# Altium project RSX_High_Power_Board.PrjPcb (part 2 of 2)

## Sheet 3V3_board.SchDoc
size A4
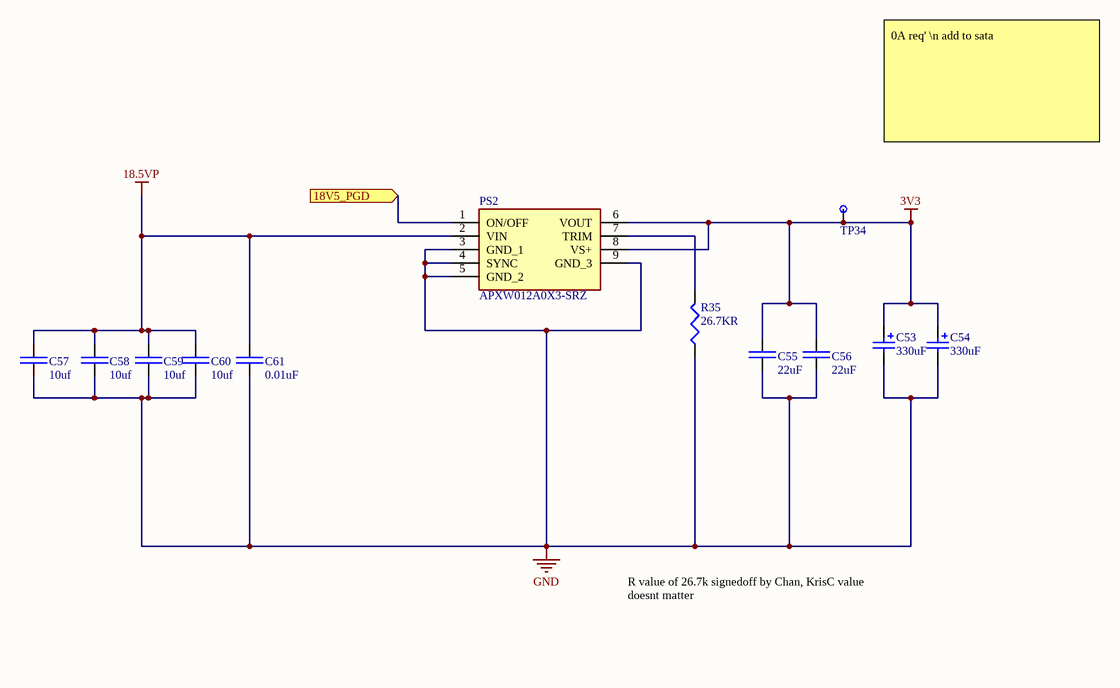
[diagram p11: 3V3_board.SchDoc]

### Parts
C53  330uF  [330uF throught hole]
C54  330uF  [330uF throught hole]
C55  22uF  [22uF Capacitor]
C56  22uF  [22uF Capacitor]
C57  10uf  [10uF capacitor LPB]
C58  10uf  [10uF capacitor LPB]
C59  10uf  [10uF capacitor LPB]
C60  10uf  [10uF capacitor LPB]
C61  0.01uF  [0.01uF capacitor]
PS2  APXW012A0X3-SRZ  [APXW012A0X3SRZ]
R35  26.7KR  [26.7KR Resistor]
TP34  TestPt  [50_MIL_PAD]  (value not drawn)

### Ports
18V5_PGD (in)

### Nets
3V3: C53.1 C54.1 C55.2 C56.2 PS2.6(VOUT) PS2.8(VS+) TP34.1
18.5VP: C57.2 C58.2 C59.2 C60.2 C61.2 PS2.2(VIN)
GND: C53.2 C54.2 C55.1 C56.1 C57.1 C58.1 C59.1 C60.1 C61.1 PS2.3(GND_1) PS2.4(SYNC) PS2.5(GND_2) PS2.9(GND_3) R35.1
NetPS1_1: PS2.1(ON/OFF) ; port 18V5_PGD
NetPS2_7: PS2.7(TRIM) R35.2

### Notes on the sheet
- 0A req' \n add to sata
- R value of 26.7k signedoff by Chan, KrisC value doesnt matter

### Library data of the parts
C53 C54 = 35ZLH330MEFCT810X12.5: CAP ALUM 330UF 20% 35V RADIAL; Manufacturer 1: Rubycon; Ripple Current: 731.5mA; Impedance: 39mR; Life (Hours): 10000Hour; Supplier 1: Digi-Key; Supplier Part Number 1: 1189-3752-1-ND; Manufacturer Part Number 1: 35ZLH330MEFCT810X12.5; Stock 1: 14330; Pricing 1: 1=0,52000, 10=0,36900, 100=0,24280 (USD); RoHS: Yes; Mount: Through Hole; Case/Package: Radial; Min Operating Temperature: -40°C; Max Operating Temperature: 105°C; Package Quantity: 1000; Capacitance: 330uF; Packaging: Tape and Reel; Tolerance: 20%; Voltage Rating: 35V; Lead Pitch: 0.197inch; Height - Seated (Max): 0.551inch; ComponentLink1URL: http://www.rubycon.co.jp/en/catalog/e_pdfs/aluminum/e_ZLH.pdf?src-supplier=Digi-Key; ComponentLink1Description: http://www.rubycon.co.jp/en/catalog/e_pdfs/aluminum/e_ZLH.pdf?src-supplier=Digi-Key; ComponentLink2URL: http://www.rubycon.co.jp/en/catalog/e_pdfs/aluminum/Radial_Lead_Alumi_Eng.pdf?src-supplier=Digi-Key; ComponentLink2Description: http://www.rubycon.co.jp/en/catalog/e_pdfs/aluminum/Radial_Lead_Alumi_Eng.pdf?src-supplier=Digi-Key
C55 C56 = GRM32ER71E226KE15L: Cap Ceramic 22uF 25V X7R 10% SMD 1210 125C Embossed T/R; Manufacturer 1: Murata; Supplier 1: Digi-Key; Supplier Part Number 1: 490-5313-6-ND; Manufacturer Part Number 1: GRM32ER71E226KE15L; Stock 1: 52660; Pricing 1: 1=1,78000, 10=1,40600, 100=1,05410, 500=0,79646 (USD); RoHS: Yes; Mount: Surface Mount; Case/Package: 1210; Number of Pins: 2; Case Code (Metric): 3225; Case Code (Imperial): 1210; Material: Ceramic; Min Operating Temperature: -55°C; Max Operating Temperature: 125°C; Capacitance: 22uF; Tolerance: 10%; Dielectric: X7R; Voltage Rating: 25V; Packaging: Tape and Reel; Package Quantity: 1; Voltage Rating (DC): 25V; Termination: SMD/SMT; Voltage: 25V; Length: 3.2mm; Height: 2.5mm; Width: 0.098inch; Thickness: 0.106inch; Depth: 2.5mm; Radiation Hardening: No; REACH SVHC: No SVHC; Lead Free: Lead Free; ComponentLink1URL: https://datasheet.ciiva.com/6072/1697714-6072768.pdf?src-supplier=Farnell; ComponentLink1Description: https://datasheet.ciiva.com/6072/1697714-6072768.pdf?src-supplier=Farnell; ComponentLink2URL: https://datasheet.ciiva.com/16497/product-16497009.pdf?src-supplier=Future+Electronics; ComponentLink2Description: https://datasheet.ciiva.com/16497/product-16497009.pdf?src-supplier=Future+Electronics; ComponentLink3URL: https://datasheet.ciiva.com/3776/2741grm32er71e226ke1523-3776996.pdf?src-supplier=Arrow; ComponentLink3Description: https://datasheet.ciiva.com/3776/2741grm32er71e226ke1523-3776996.pdf?src-supplier=Arrow; ComponentLink4URL: https://datasheet.ciiva.com/11789/0900766b80ef921d-11789129.pdf?src-supplier=RSComponents; ComponentLink4Description: https://datasheet.ciiva.com/11789/0900766b80ef921d-11789129.pdf?src-supplier=RSComponents; ComponentLink5URL: https://datasheet.ciiva.com/29201/451826-da-01-de-vs-kondens-grm32-er71e-226ke15l-29201795.pdf?src-supplier=Conrad; ComponentLink5Description: https://datasheet.ciiva.com/29201/451826-da-01-de-vs-kondens-grm32-er71e-226ke15l-29201795.pdf?src-supplier=Conrad; ComponentLink6URL: https://datasheet.ciiva.com/175/partnumbering-e-01-175746.pdf?src-supplier=Digi-Key; ComponentLink6Description: https://datasheet.ciiva.com/175/partnumbering-e-01-175746.pdf?src-supplier=Digi-Key; ComponentLink7URL: https://datasheet.ciiva.com/175/partnumbering-e-01-175747.pdf?src-supplier=Digi-Key; ComponentLink7Description: https://datasheet.ciiva.com/175/partnumbering-e-01-175747.pdf?src-supplier=Digi-Key; ComponentLink8URL: https://datasheet.ciiva.com/175/partnumbering-e-01-175748.pdf?src-supplier=Digi-Key; ComponentLink8Description: https://datasheet.ciiva.com/175/partnumbering-e-01-175748.pdf?src-supplier=Digi-Key; ComponentLink9URL: https://datasheet.ciiva.com/22703/1697714-22703397.pdf?src-supplier=Element14; ComponentLink9Description: https://datasheet.ciiva.com/22703/1697714-22703397.pdf?src-supplier=Element14; Category: Capacitor
C57-C60 = GRT31CR61H106ME01L: CAP CER 10UF 50V X5R 1206; Manufacturer 1: Murata; Tolerance: 20%; Supplier 1: Digi-Key; Supplier Part Number 1: 490-12457-1-ND; Manufacturer Part Number 1: GRT31CR61H106ME01L; Stock 1: 8159; Pricing 1: 1=0,50000, 10=0,34900, 100=0,20920, 500=0,15690, 1000=0,13249 (USD); RoHS: Yes; Mount: Surface Mount; Case/Package: 1206; Case Code (Metric): 3216; Case Code (Imperial): 1206; Min Operating Temperature: -55°C; Max Operating Temperature: 85°C; Packaging: Tape and Reel; Capacitance: 10uF; Voltage Rating: 50V; Length: 0.126inch; Width: 0.063inch; Thickness: 0.071inch; Ratings: AEC-Q200; ComponentLink1URL: http://search.murata.co.jp/Ceramy/image/img/A01X/G101/ENG/GRT31CR61H106ME01-01.pdf?src-supplier=Digi-Key; ComponentLink1Description: http://search.murata.co.jp/Ceramy/image/img/A01X/G101/ENG/GRT31CR61H106ME01-01.pdf?src-supplier=Digi-Key; Category: Capacitor
C61 = C0603C103KARACAUTO: Cap Ceramic 0.01uF 250V X7R 10% Pad SMD 0603 125C Automotive T/R; Manufacturer 1: KEMET; Capacitance: 10nF; Supplier 1: Digi-Key; Supplier Part Number 1: 399-17960-1-ND; Manufacturer Part Number 1: C0603C103KARACAUTO; Stock 1: 8483; Pricing 1: 1=0,90000, 10=0,68500, 100=0,49040, 500=0,37964, 1000=0,32691 (USD); RoHS: No; Mount: Surface Mount; Case/Package: 0603; Case Code (Imperial): 0603; Case Code (Metric): 1608; Min Operating Temperature: -55°C; Max Operating Temperature: 125°C; Packaging: Tape and Reel; Tolerance: 10%; Voltage Rating: 250V; Ratings: AEC-Q200; ComponentLink1URL: https://api.kemet.com/component-edge/download/datasheet/C0603C103KARACAUTO.pdf?src-supplier=Digi-Key; ComponentLink1Description: https://api.kemet.com/component-edge/download/datasheet/C0603C103KARACAUTO.pdf?src-supplier=Digi-Key; Category: Capacitor
PS2 = APXW012A0X3-SRZ: Power Supply; Manufacturer_Name: ABB; Datasheet Link: https://datasheet.datasheetarchive.com/originals/distributors/Datasheets_SAMA/683ccf345f63793608341fe806dd9fff.pdf; Height: 10mm; Manufacturer_Part_Number: APXW012A0X3-SRZ; Mouser Part Number: 894-APXW012A0X3-SRZ; Mouser Price/Stock: https://www.mouser.co.uk/ProductDetail/ABB/APXW012A0X3-SRZ?qs=R2DZpqZpp70Xpp2aKRKJXQ%3D%3D
R35 = ERA-3AEB2672V: RES SMD 26.7KOHM 0.1% 1/10W 0603; Manufacturer 1: Panasonic; Power Rating: 100mW; Voltage Rating: 75V; Temperature Coefficient: 25ppm/°C; Supplier 1: Digi-Key; Supplier Part Number 1: P26.7KDBCT-ND; Manufacturer Part Number 1: ERA-3AEB2672V; Stock 1: 17260; Pricing 1: 1=0,35000, 10=0,30000, 100=0,11720, 1000=0,04906, 2500=0,04498 (USD); RoHS: Yes; Mount: Surface Mount; Case/Package: 0603; Number of Pins: 2; Case Code (Metric): 1608; Case Code (Imperial): 0603; Contact Plating: Tin; Min Operating Temperature: -55°C; Max Operating Temperature: 155°C; Resistance: 26.7kR; Tolerance: 0.1%; Packaging: Tape and Reel; Package Quantity: 1; Composition: Thin Film,Metal Film; Number of Terminations: 2; Max Power Dissipation: 100mW; Voltage Rating (DC): 75V; Features: Automotive AEC-Q200; Length: 1.6mm; Height: 0.45mm; Width: 0.8mm; Depth: 0.8mm; Radiation Hardening: No; Lead Free: Lead Free; REACH SVHC: No SVHC; ComponentLink1URL: https://datasheet.ciiva.com/11814/0900766b80eb1d8c-11814836.pdf?src-supplier=RSComponents; ComponentLink1Description: https://datasheet.ciiva.com/11814/0900766b80eb1d8c-11814836.pdf?src-supplier=RSComponents; ComponentLink2URL: https://datasheet.ciiva.com/5987/485442-5987192.pdf?src-supplier=Farnell; ComponentLink2Description: https://datasheet.ciiva.com/5987/485442-5987192.pdf?src-supplier=Farnell; ComponentLink3URL: https://datasheet.ciiva.com/5987/485442-5987183.pdf?src-supplier=Farnell; ComponentLink3Description: https://datasheet.ciiva.com/5987/485442-5987183.pdf?src-supplier=Farnell; ComponentLink4URL: https://datasheet.ciiva.com/46422/485442-46422629.pdf?src-supplier=Element14; ComponentLink4Description: https://datasheet.ciiva.com/46422/485442-46422629.pdf?src-supplier=Element14; ComponentLink5URL: https://datasheet.ciiva.com/17210/aoa0000ce26-17210681.pdf?src-supplier=Avnet+Europe; ComponentLink5Description: https://datasheet.ciiva.com/17210/aoa0000ce26-17210681.pdf?src-supplier=Avnet+Europe

## Sheet 5V_board.SchDoc
size A4
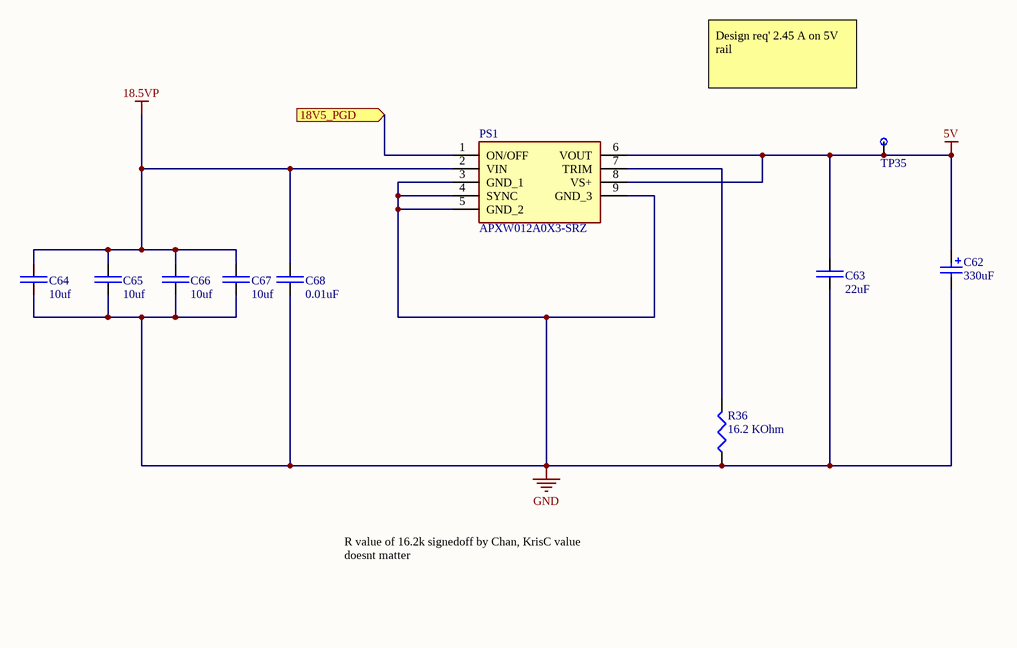
[diagram p12: 5V_board.SchDoc]

### Parts
C62  330uF  [330uF throught hole]
C63  22uF  [22uF Capacitor]
C64  10uf  [10uF capacitor LPB]
C65  10uf  [10uF capacitor LPB]
C66  10uf  [10uF capacitor LPB]
C67  10uf  [10uF capacitor LPB]
C68  0.01uF  [0.01uF capacitor]
PS1  APXW012A0X3-SRZ  [APXW012A0X3SRZ]
R36  16.2 KOhm  [16.2 KOhm Resistor]
TP35  TestPt  [50_MIL_PAD]  (value not drawn)

### Ports
18V5_PGD (in)

### Nets
5V: C62.1 C63.2 PS1.6(VOUT) PS1.8(VS+) TP35.1
18.5VP: C64.2 C65.2 C66.2 C67.2 C68.2 PS1.2(VIN)
GND: C62.2 C63.1 C64.1 C65.1 C66.1 C67.1 C68.1 PS1.3(GND_1) PS1.4(SYNC) PS1.5(GND_2) PS1.9(GND_3) R36.1
NetPS1_1: PS1.1(ON/OFF) ; port 18V5_PGD
NetPS1_7: PS1.7(TRIM) R36.2

### Notes on the sheet
- Design req' 2.45 A on 5V rail
- R value of 16.2k signedoff by Chan, KrisC value doesnt matter

### Library data of the parts
C62 = 35ZLH330MEFCT810X12.5: as C53 on sheet 3V3_board; Supplier 1: Digi-Key; Supplier Part Number 1: 1189-3752-1-ND; Manufacturer Part Number 1: 35ZLH330MEFCT810X12.5; Stock 1: 14330; Pricing 1: 1=0,52000, 10=0,36900, 100=0,24280 (USD); RoHS: Yes; Mount: Through Hole; Case/Package: Radial; Min Operating Temperature: -40°C; Max Operating Temperature: 105°C; Package Quantity: 1000; Capacitance: 330uF; Packaging: Tape and Reel; Tolerance: 20%; Voltage Rating: 35V; Lead Pitch: 0.197inch; Height - Seated (Max): 0.551inch; ComponentLink1URL: http://www.rubycon.co.jp/en/catalog/e_pdfs/aluminum/e_ZLH.pdf?src-supplier=Digi-Key; ComponentLink1Description: http://www.rubycon.co.jp/en/catalog/e_pdfs/aluminum/e_ZLH.pdf?src-supplier=Digi-Key; ComponentLink2URL: http://www.rubycon.co.jp/en/catalog/e_pdfs/aluminum/Radial_Lead_Alumi_Eng.pdf?src-supplier=Digi-Key; ComponentLink2Description: http://www.rubycon.co.jp/en/catalog/e_pdfs/aluminum/Radial_Lead_Alumi_Eng.pdf?src-supplier=Digi-Key
C63 = GRM32ER71E226KE15L: as C55 on sheet 3V3_board; Supplier 1: Digi-Key; Supplier Part Number 1: 490-5313-6-ND; Manufacturer Part Number 1: GRM32ER71E226KE15L; Stock 1: 52660; Pricing 1: 1=1,78000, 10=1,40600, 100=1,05410, 500=0,79646 (USD); RoHS: Yes; Mount: Surface Mount; Case/Package: 1210; Number of Pins: 2; Case Code (Metric): 3225; Case Code (Imperial): 1210; Material: Ceramic; Min Operating Temperature: -55°C; Max Operating Temperature: 125°C; Capacitance: 22uF; Tolerance: 10%; Dielectric: X7R; Voltage Rating: 25V; Packaging: Tape and Reel; Package Quantity: 1; Voltage Rating (DC): 25V; Termination: SMD/SMT; Voltage: 25V; Length: 3.2mm; Height: 2.5mm; Width: 0.098inch; Thickness: 0.106inch; Depth: 2.5mm; Radiation Hardening: No; REACH SVHC: No SVHC; Lead Free: Lead Free; ComponentLink1URL: https://datasheet.ciiva.com/6072/1697714-6072768.pdf?src-supplier=Farnell; ComponentLink1Description: https://datasheet.ciiva.com/6072/1697714-6072768.pdf?src-supplier=Farnell; ComponentLink2URL: https://datasheet.ciiva.com/16497/product-16497009.pdf?src-supplier=Future+Electronics; ComponentLink2Description: https://datasheet.ciiva.com/16497/product-16497009.pdf?src-supplier=Future+Electronics; ComponentLink3URL: https://datasheet.ciiva.com/3776/2741grm32er71e226ke1523-3776996.pdf?src-supplier=Arrow; ComponentLink3Description: https://datasheet.ciiva.com/3776/2741grm32er71e226ke1523-3776996.pdf?src-supplier=Arrow; ComponentLink4URL: https://datasheet.ciiva.com/11789/0900766b80ef921d-11789129.pdf?src-supplier=RSComponents; ComponentLink4Description: https://datasheet.ciiva.com/11789/0900766b80ef921d-11789129.pdf?src-supplier=RSComponents; ComponentLink5URL: https://datasheet.ciiva.com/29201/451826-da-01-de-vs-kondens-grm32-er71e-226ke15l-29201795.pdf?src-supplier=Conrad; ComponentLink5Description: https://datasheet.ciiva.com/29201/451826-da-01-de-vs-kondens-grm32-er71e-226ke15l-29201795.pdf?src-supplier=Conrad; ComponentLink6URL: https://datasheet.ciiva.com/175/partnumbering-e-01-175746.pdf?src-supplier=Digi-Key; ComponentLink6Description: https://datasheet.ciiva.com/175/partnumbering-e-01-175746.pdf?src-supplier=Digi-Key; ComponentLink7URL: https://datasheet.ciiva.com/175/partnumbering-e-01-175747.pdf?src-supplier=Digi-Key; ComponentLink7Description: https://datasheet.ciiva.com/175/partnumbering-e-01-175747.pdf?src-supplier=Digi-Key; ComponentLink8URL: https://datasheet.ciiva.com/175/partnumbering-e-01-175748.pdf?src-supplier=Digi-Key; ComponentLink8Description: https://datasheet.ciiva.com/175/partnumbering-e-01-175748.pdf?src-supplier=Digi-Key; ComponentLink9URL: https://datasheet.ciiva.com/22703/1697714-22703397.pdf?src-supplier=Element14; ComponentLink9Description: https://datasheet.ciiva.com/22703/1697714-22703397.pdf?src-supplier=Element14; Category: Capacitor
C64-C67 = GRT31CR61H106ME01L: as C57 on sheet 3V3_board; Supplier 1: Digi-Key; Supplier Part Number 1: 490-12457-1-ND; Manufacturer Part Number 1: GRT31CR61H106ME01L; Stock 1: 8159; Pricing 1: 1=0,50000, 10=0,34900, 100=0,20920, 500=0,15690, 1000=0,13249 (USD); RoHS: Yes; Mount: Surface Mount; Case/Package: 1206; Case Code (Metric): 3216; Case Code (Imperial): 1206; Min Operating Temperature: -55°C; Max Operating Temperature: 85°C; Packaging: Tape and Reel; Capacitance: 10uF; Voltage Rating: 50V; Length: 0.126inch; Width: 0.063inch; Thickness: 0.071inch; Ratings: AEC-Q200; ComponentLink1URL: http://search.murata.co.jp/Ceramy/image/img/A01X/G101/ENG/GRT31CR61H106ME01-01.pdf?src-supplier=Digi-Key; ComponentLink1Description: http://search.murata.co.jp/Ceramy/image/img/A01X/G101/ENG/GRT31CR61H106ME01-01.pdf?src-supplier=Digi-Key; Category: Capacitor
C68 = C0603C103KARACAUTO: as C61 on sheet 3V3_board; Supplier 1: Digi-Key; Supplier Part Number 1: 399-17960-1-ND; Manufacturer Part Number 1: C0603C103KARACAUTO; Stock 1: 8483; Pricing 1: 1=0,90000, 10=0,68500, 100=0,49040, 500=0,37964, 1000=0,32691 (USD); RoHS: No; Mount: Surface Mount; Case/Package: 0603; Case Code (Imperial): 0603; Case Code (Metric): 1608; Min Operating Temperature: -55°C; Max Operating Temperature: 125°C; Packaging: Tape and Reel; Tolerance: 10%; Voltage Rating: 250V; Ratings: AEC-Q200; ComponentLink1URL: https://api.kemet.com/component-edge/download/datasheet/C0603C103KARACAUTO.pdf?src-supplier=Digi-Key; ComponentLink1Description: https://api.kemet.com/component-edge/download/datasheet/C0603C103KARACAUTO.pdf?src-supplier=Digi-Key; Category: Capacitor
PS1 = APXW012A0X3-SRZ: Power Supply; Manufacturer_Name: ABB; Datasheet Link: https://datasheet.datasheetarchive.com/originals/distributors/Datasheets_SAMA/683ccf345f63793608341fe806dd9fff.pdf; Height: 10mm; Manufacturer_Part_Number: APXW012A0X3-SRZ; Mouser Part Number: 894-APXW012A0X3-SRZ; Mouser Price/Stock: https://www.mouser.co.uk/ProductDetail/ABB/APXW012A0X3-SRZ?qs=R2DZpqZpp70Xpp2aKRKJXQ%3D%3D
R36 = RT0603DRD0716K2L: RES SMD 16.2KOHM 0.5% 1/10W 0603; Manufacturer 1: Yageo; Resistance: 16.2kR; Max Power Dissipation: 100mW; Temperature Coefficient: 25ppm/°C; Voltage Rating (DC): 50V; Supplier 1: Digi-Key; Supplier Part Number 1: 311-16.2KDCT-ND; Manufacturer Part Number 1: RT0603DRD0716K2L; Stock 1: 8163; Pricing 1: 1=0,20000, 10=0,16800, 100=0,06570, 1000=0,02750, 2500=0,02521 (USD); RoHS: Yes; Case/Package: 0603; Case Code (Metric): 1608; Case Code (Imperial): 0603; Min Operating Temperature: -55°C; Max Operating Temperature: 155°C; Package Quantity: 1; Tolerance: 0.5%; Packaging: Tape and Reel; Composition: Thin Film; Number of Terminations: 2; Features: Moisture Resistant; Length: 0.063inch; Height: 0.022inch; Width: 0.031inch; Lead Free: Lead Free; ComponentLink1URL: http://www.yageo.com/documents/recent/PYu-RT_1-to-0.01_RoHS_L_8.pdf?src-supplier=Digi-Key; ComponentLink1Description: http://www.yageo.com/documents/recent/PYu-RT_1-to-0.01_RoHS_L_8.pdf?src-supplier=Digi-Key; Category: Resistors

## Sheet 12V_board.SchDoc
size A4
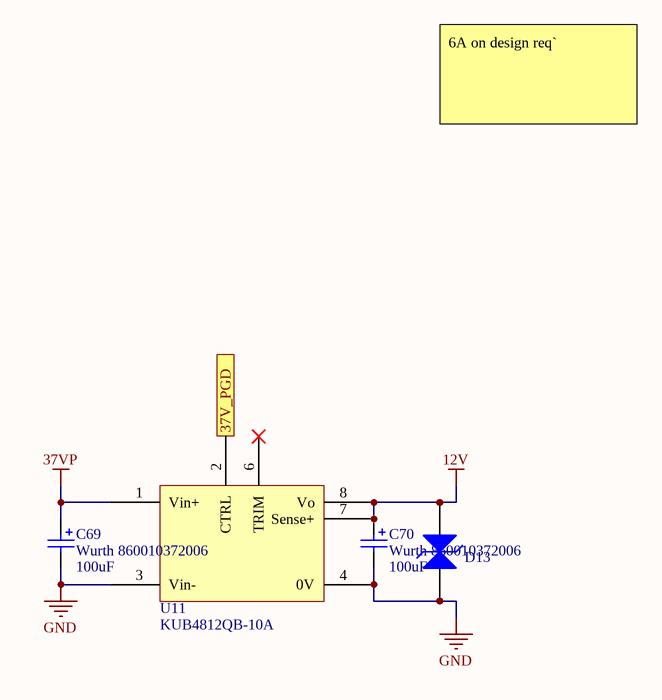
[diagram p13: 12V_board.SchDoc]

### Parts
C69  Wurth 860010372006  value 100uF  [Wurth 860010372006]
C70  Wurth 860010372006  value 100uF  [Wurth 860010372006]
D13  TVS_DIODE  [SMBJ54A-13-F]  (value not drawn)
U11  KUB4812QB-10A  [KUB48XXQB-10A]

### Ports
37V_PGD (in)

### Nets
12V: C70.1 D13.1(A) U11.7(Sense+) U11.8(Vo)
37VP: C69.1 U11.1(Vin+)
GND: C69.2 C70.2 D13.2(K) U11.3(Vin-) U11.4(0V)
NetR43_2: U11.2(CTRL) ; port 37V_PGD

Not connected (* = marked no-connect by the designer): U11 6(TRIM)*

### Notes on the sheet
- 6A on design req`

### Library data of the parts
C69 C70 = Wurth 860010372006: Polarized Capacitor (Radial)
D13 = TVS_DIODE: TVS Diode; Published: 8-Jun-2000; LatestRevisionDate: 17-Jul-2002; LatestRevisionNote: Re-released for DXP Platform.; PackageVersion: Sep-1996; PackageReference: SMC; Publisher: Altium Limited; PackageDescription: DO-214-AB/SMC; 2 C-Bend Leads; Body 7.9 x 5.9 mm, inc. leads (LxW); Code_JEDEC: DO-214-AB
U11 = KUB4812QB-10A: 12V 10A DC DC step down

## Sheet 24V_board.SchDoc
size A4
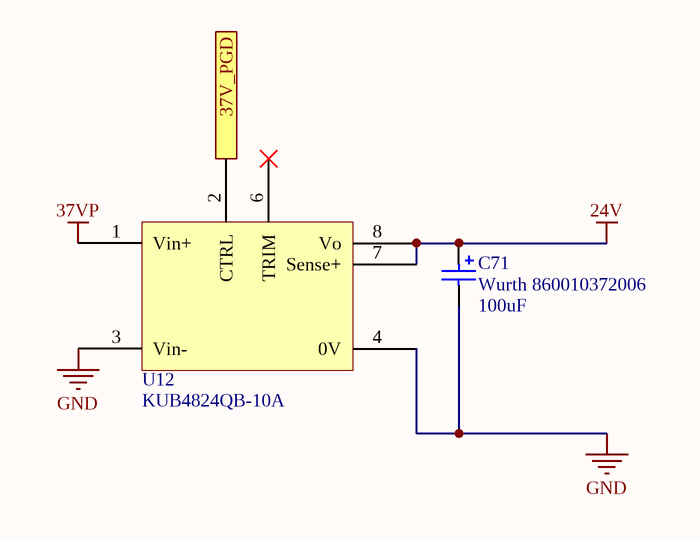
[diagram p14: 24V_board.SchDoc]

### Parts
C71  Wurth 860010372006  value 100uF  [Wurth 860010372006]
U12  KUB4824QB-10A  [KUB48XXQB-10A]

### Ports
37V_PGD (in)

### Nets
24V: C71.1 U12.7(Sense+) U12.8(Vo)
37VP: U12.1(Vin+)
GND: C71.2 U12.3(Vin-) U12.4(0V)
NetR43_2: U12.2(CTRL) ; port 37V_PGD

Not connected (* = marked no-connect by the designer): U12 6(TRIM)*

### Library data of the parts
C71 = Wurth 860010372006: Polarized Capacitor (Radial)
U12 = KUB4812QB-10A: 12V 10A DC DC step down

## Sheet 37V_efuse.SchDoc
size A4
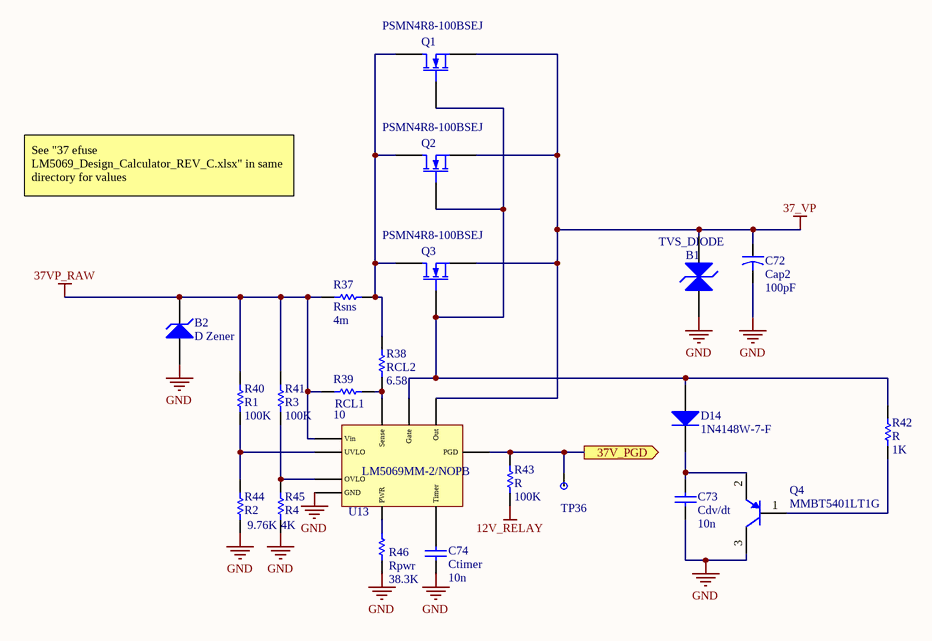
[diagram p15: 37V_efuse.SchDoc]

### Parts
B1  TVS_DIODE  [SMBJ54A-13-F]
B2  D Zener  [DIODE-0.7]
C72  Cap2  value 100pF  [CAPR5-4X5]
C73  Cdv/dt  value 10n  [RAD-0.3]
C74  Ctimer  value 10n  [RAD-0.3]
D14  1N4148W-7-F  [DIOD-SOD123-2_V]
Q1  PSMN4R8-100BSEJ  [DPAK254P1420X457-3N]
Q2  PSMN4R8-100BSEJ  [DPAK254P1420X457-3N]
Q3  PSMN4R8-100BSEJ  [DPAK254P1420X457-3N]
Q4  MMBT5401LT1G  [ONSC-SOT-23-3-318-08_V]
R37  Rsns  value 4m  [RESC1608X06N_0603]
R38  RCL2  value 6.58  [RESC1608X06N_0603]
R39  RCL1  value 10  [RESC1608X06N_0603]
R40  R1  value 100K  [RESC1608X06N_0603]
R41  R3  value 100K  [RESC1608X06N_0603]
R42  R  value 1K  [RESC1608X06N_0603]
R43  R  value 100K  [RESC1608X06N_0603]
R44  R2  value 9.76K  [RESC1608X06N_0603]
R45  R4  value 4K  [RESC1608X06N_0603]
R46  Rpwr  value 38.3K  [RESC1608X06N_0603]
TP36  TestPt  [50_MIL_PAD]  (value not drawn)
U13  LM5069MM-2/NOPB  [TSSOP50P490X110-10N]

### Ports
37V_PGD (out)

### Nets
12V_RELAY: R43.1
37_VP: B1.2(K) C72.1 Q1.3(S) Q2.3(S) Q3.3(S) U13.9(Out)
37VP_RAW: B2.2(K) R37.1 R39.1 R40.2 R41.2 U13.2(Vin)
GND: B1.1(A) B2.1(A) C72.2 C73.2 C74.1 Q4.3(C) R44.1 R45.1 R46.1 U13.5(GND)
NetC73_1: C73.1 D14.2(K) Q4.2(E)
NetC74_2: C74.2 U13.6(Timer)
NetD14_1: D14.1(A) Q1.1(G) Q2.1(G) Q3.1(G) R42.2 U13.10(Gate)
NetQ1_2: Q1.2(D) Q2.2(D) Q3.2(D) R37.2 R38.2
NetQ4_1: Q4.1(B) R42.1
NetR38_1: R38.1 R39.2 U13.1(Sense)
NetR40_1: R40.1 R44.2 U13.3(UVLO)
NetR41_1: R41.1 R45.2 U13.4(OVLO)
NetR43_2: R43.2 TP36.1 U13.8(PGD) ; port 37V_PGD
NetR46_2: R46.2 U13.7(PWR)

### Notes on the sheet
- See "37 efuse LM5069_Design_Calculator_REV_C.xlsx" in same directory for values

### Library data of the parts
B1 = TVS_DIODE: TVS Diode; Published: 8-Jun-2000; LatestRevisionDate: 17-Jul-2002; LatestRevisionNote: Re-released for DXP Platform.; PackageVersion: Sep-1996; PackageReference: SMC; Publisher: Altium Limited; PackageDescription: DO-214-AB/SMC; 2 C-Bend Leads; Body 7.9 x 5.9 mm, inc. leads (LxW); Code_JEDEC: DO-214-AB
B2 = D Zener: Zener Diode; Published: 8-Jun-2000; LatestRevisionDate: 17-Jul-2002; LatestRevisionNote: Re-released for DXP Platform.; PackageReference: DIODE-0.7; Publisher: Altium Limited; PackageDescription: Diode, Thru-Hole; 2 Leads; 0.7 in Pin Spacing
C72 = Cap2: Capacitor; Published: 23-Sep-2002; PackageReference: CAPR5-4X5; Publisher: Altium Limited; PackageDescription: Capacitor; 2 Leads
C73 C74 = Cap: Capacitor; Published: 8-Jun-2000; LatestRevisionDate: 17-Jul-2002; LatestRevisionNote: Re-released for DXP Platform.; PackageReference: RAD-0.3; Publisher: Altium Limited; PackageDescription: Radial Cap, Thru-Hole; 2 Leads; 0.3 in Pin Spacing
D14 = CMP-2000-04932-2: Fast Switching Diode, 100 V, 0.15 A, -65 to 150 degC, 2-Pin?SOD123, RoHS, Tape and Reel; Recovery Time: 4ns; Brand: DiodesIncorporated; Unit Weight: 0.000353oz; Max Surge Current: 2A; Peak Reverse Voltage: 100V; Ir - Reverse Current: 1uA; Vf - Forward Voltage: 1.25V; Configuration: Single; If - Forward Current: 0.15A; Product Category: Diodes-GeneralPurpose,Power,Switching; Operating Temperature Range: -65Cto+150C; Packaging: Reel; Manufacturer URL: http://www.diodes.com/; Maximum Operating Temperature: +150C; Height: 1.25mm; Minimum Operating Temperature: -65C; Product: SwitchingDiodes; Package URL: http://www.diodes.com/datasheets/ds18004.pdf; Type: SwitchingDiode; Package Reference: SOD123-2; Width: 1.7mm; Datasheet URL: http://www.farnell.com/datasheets/1915529.pdf; Datasheet Version: Rev. 24-2, 10/2013; Series: 1N4148; Factory Pack Quantity: 3000; Length: 2.85mm; RoHS: True; Manufacturer: DiodesIncorporated; Mounting Style: SMD/SMT; Package / Case: SOD-123
Q1-Q3 = PSMN4R8-100BSEJ: N-Channel MOSFET; Published: 8-Jun-2000; LatestRevisionDate: 17-Jul-2002; LatestRevisionNote: Re-released for DXP Platform.; PackageVersion: 1995/1996; PackageReference: E3; Publisher: Altium Limited; PackageDescription: TO, Flat Index; 3 In-Line, Axial Leads; Body Dia. 4.6mm; Lead Dia. 0.5 mm (max); Supplier 1: Digi-Key; Supplier Part Number 1: 1727-1103-1-ND
Q4 = CMP-1048-00557-1: High Voltage Transistor, PNP Silicon, 3-Pin SOT-23, Pb-Free, Tape and Reel; Manufacturer: On Semiconductor; fT Min (MHz): 100; IC Continuous (A): -0.5; Packing: Tape and Reel; PackageDescription: 3-Pin Small Outline Transistor, Body 2.92 x 1.3 mm, Pitch 0.95 mm; PartNumber: MMBT5401LT1G; DatasheetVersion: Rev. 11; PackageReference: SOT-23-3-318-08; Polarity: PNP; ComponentLink1URL: http://www.onsemi.com/; ComponentLink3URL: http://www.onsemi.cn/pub_link/Collateral/318-08.PDF; ComponentLink3Description: Package Specification; ComponentLink1Description: Manufacturer URL; Mounting Technology: Surface Mount; ComponentLink2URL: http://www.onsemi.cn/pub_link/Collateral/MMBT5401LT1-D.PDF; RoHS: TRUE; ComponentLink2Description: Datasheet; PackageVersion: Rev. AP, 11/2009
R37-R46 = Res1: Resistor; Published: 8-Jun-2000; LatestRevisionDate: 17-Jul-2002; LatestRevisionNote: Re-released for DXP Platform.; PackageReference: AXIAL-0.3; Publisher: Altium Limited; PackageDescription: Axial Device, Thru-Hole; 2 Leads; 0.3 in Pin Spacing
U13 = LM5069MM-2/NOPB: Hot Swap Controller 1-CH 80V N-Channel Positive High Voltage 10-Pin VSSOP T/R; Manufacturer 1: TI National Semiconductor; Min Supply Voltage: 9V; Number of Channels: 1; Output Voltage: 12V; Supplier 1: Digi-Key; Manufacturer Part Number 1: LM5069MM-2/NOPB; Stock 1: 115715; Pricing 1: 1=3.00000, 10=2.69700, 25=2.54920, 100=2.09610, 250=1.88080, 500=1.81280 (USD); RoHS: Yes; Mount: Surface Mount; Case/Package: MSOP; Number of Pins: 10; Min Operating Temperature: -40°C; Max Operating Temperature: 125°C; Packaging: Tape and Reel; Package Quantity: 1000; Max Supply Voltage: 80V; Number of Outputs: 1; Length: 3mm; Height: 0.86mm; Depth: 3.1mm; Width: 3mm; Radiation Hardening: No; Lead Free: Lead Free; REACH SVHC: No SVHC; ComponentLink1URL: https://datasheet.ciiva.com/15099/getdatasheetpartid-628880-15099677.pdf?src-supplier=Verical; ComponentLink1Description: https://datasheet.ciiva.com/15099/getdatasheetpartid-628880-15099677.pdf?src-supplier=Verical; ComponentLink2URL: https://datasheet.ciiva.com/3222/lm5069-3222438.pdf?src-supplier=Avnet; ComponentLink2Description: https://datasheet.ciiva.com/3222/lm5069-3222438.pdf?src-supplier=Avnet; ComponentLink3URL: https://datasheet.ciiva.com/3222/lm5069-3222470.pdf?src-supplier=Avnet; ComponentLink3Description: https://datasheet.ciiva.com/3222/lm5069-3222470.pdf?src-supplier=Avnet; ComponentLink4URL: https://datasheet.ciiva.com/6609/lm5069-6609670.pdf?src-supplier=Digi-Key; ComponentLink4Description: https://datasheet.ciiva.com/6609/lm5069-6609670.pdf?src-supplier=Digi-Key; ComponentLink5URL: https://datasheet.ciiva.com/1511/1642228-1511437.pdf?src-supplier=Element14; ComponentLink5Description: https://datasheet.ciiva.com/1511/1642228-1511437.pdf?src-supplier=Element14; Supplier Part Number 1: LM5069MM-2/NOPBCT-ND

## Sheet 18V5_efuse.SchDoc
size A4
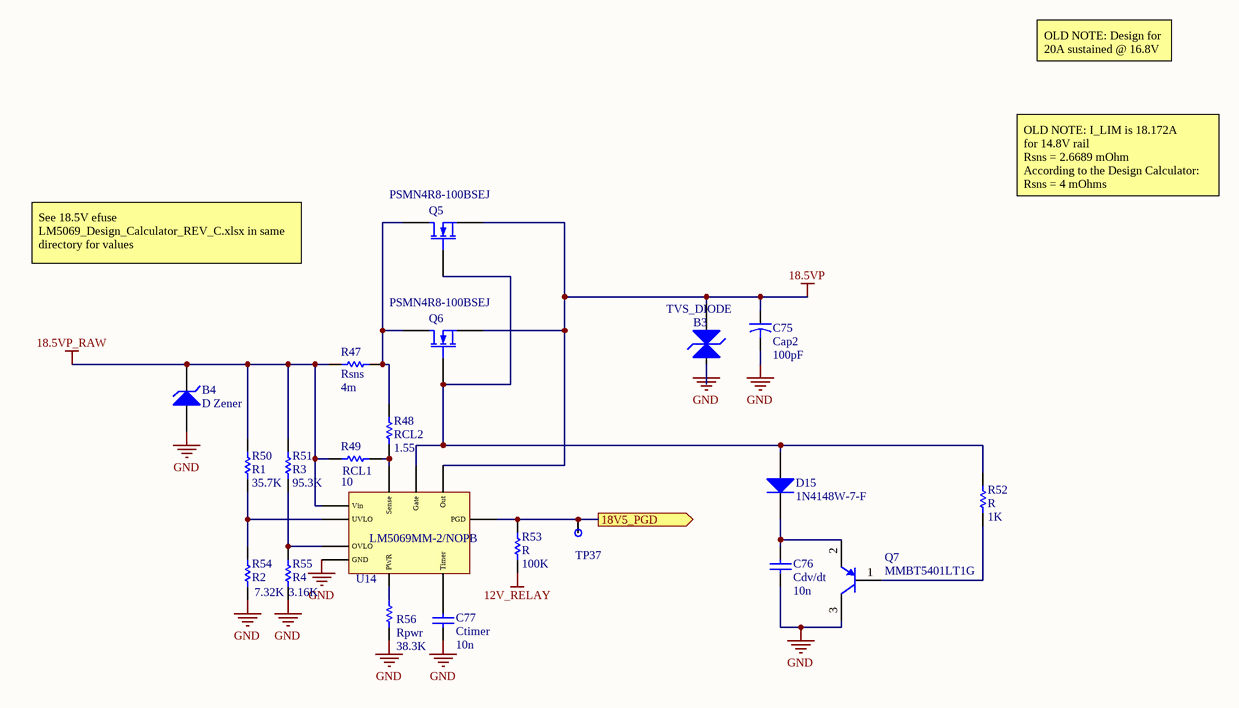
[diagram p16: 18V5_efuse.SchDoc]

### Parts
B3  TVS_DIODE  [SMBJ54A-13-F]
B4  D Zener  [DIODE-0.7]
C75  Cap2  value 100pF  [CAPR5-4X5]
C76  Cdv/dt  value 10n  [RAD-0.3]
C77  Ctimer  value 10n  [RAD-0.3]
D15  1N4148W-7-F  [DIOD-SOD123-2_V]
Q5  PSMN4R8-100BSEJ  [DPAK254P1420X457-3N]
Q6  PSMN4R8-100BSEJ  [DPAK254P1420X457-3N]
Q7  MMBT5401LT1G  [ONSC-SOT-23-3-318-08_V]
R47  Rsns  value 4m  [RESC1608X06N_0603]
R48  RCL2  value 1.55  [RESC1608X06N_0603]
R49  RCL1  value 10  [RESC1608X06N_0603]
R50  R1  value 35.7K  [RESC1608X06N_0603]
R51  R3  value 95.3K  [RESC1608X06N_0603]
R52  R  value 1K  [RESC1608X06N_0603]
R53  R  value 100K  [RESC1608X06N_0603]
R54  R2  value 7.32K  [RESC1608X06N_0603]
R55  R4  value 3.16K  [RESC1608X06N_0603]
R56  Rpwr  value 38.3K  [RESC1608X06N_0603]
TP37  TestPt  [50_MIL_PAD]  (value not drawn)
U14  LM5069MM-2/NOPB  [TSSOP50P490X110-10N]

### Ports
18V5_PGD (out)

### Nets
12V_RELAY: R53.1
18.5VP: B3.2(K) C75.1 Q5.3(S) Q6.3(S) U14.9(Out)
18.5VP_RAW: B4.2(K) R47.1 R49.1 R50.2 R51.2 U14.2(Vin)
GND: B3.1(A) B4.1(A) C75.2 C76.2 C77.1 Q7.3(C) R54.1 R55.1 R56.1 U14.5(GND)
NetC76_1: C76.1 D15.2(K) Q7.2(E)
NetC77_2: C77.2 U14.6(Timer)
NetD15_1: D15.1(A) Q5.1(G) Q6.1(G) R52.2 U14.10(Gate)
NetPS1_1: R53.2 TP37.1 U14.8(PGD) ; port 18V5_PGD
NetQ5_2: Q5.2(D) Q6.2(D) R47.2 R48.2
NetQ7_1: Q7.1(B) R52.1
NetR48_1: R48.1 R49.2 U14.1(Sense)
NetR50_1: R50.1 R54.2 U14.3(UVLO)
NetR51_1: R51.1 R55.2 U14.4(OVLO)
NetR56_2: R56.2 U14.7(PWR)

### Notes on the sheet
- OLD NOTE: Design for 20A sustained @ 16.8V
- OLD NOTE: I_LIM is 18.172A
  for 14.8V rail
  Rsns = 2.6689 mOhm                            According to the Design Calculator: Rsns = 4 mOhms
- See 18.5V efuse LM5069_Design_Calculator_REV_C.xlsx in same directory for values

### Library data of the parts
B3 = TVS_DIODE: TVS Diode; Published: 8-Jun-2000; LatestRevisionDate: 17-Jul-2002; LatestRevisionNote: Re-released for DXP Platform.; PackageVersion: Sep-1996; PackageReference: SMC; Publisher: Altium Limited; PackageDescription: DO-214-AB/SMC; 2 C-Bend Leads; Body 7.9 x 5.9 mm, inc. leads (LxW); Code_JEDEC: DO-214-AB
B4 = D Zener: Zener Diode; Published: 8-Jun-2000; LatestRevisionDate: 17-Jul-2002; LatestRevisionNote: Re-released for DXP Platform.; PackageReference: DIODE-0.7; Publisher: Altium Limited; PackageDescription: Diode, Thru-Hole; 2 Leads; 0.7 in Pin Spacing
C75 = Cap2: Capacitor; Published: 23-Sep-2002; PackageReference: CAPR5-4X5; Publisher: Altium Limited; PackageDescription: Capacitor; 2 Leads
C76 C77 = Cap: Capacitor; Published: 8-Jun-2000; LatestRevisionDate: 17-Jul-2002; LatestRevisionNote: Re-released for DXP Platform.; PackageReference: RAD-0.3; Publisher: Altium Limited; PackageDescription: Radial Cap, Thru-Hole; 2 Leads; 0.3 in Pin Spacing
D15 = CMP-2000-04932-2: as D14 on sheet 37V_efuse; Product Category: Diodes-GeneralPurpose,Power,Switching; Operating Temperature Range: -65Cto+150C; Packaging: Reel; Manufacturer URL: http://www.diodes.com/; Maximum Operating Temperature: +150C; Height: 1.25mm; Minimum Operating Temperature: -65C; Product: SwitchingDiodes; Package URL: http://www.diodes.com/datasheets/ds18004.pdf; Type: SwitchingDiode; Package Reference: SOD123-2; Width: 1.7mm; Datasheet URL: http://www.farnell.com/datasheets/1915529.pdf; Datasheet Version: Rev. 24-2, 10/2013; Series: 1N4148; Factory Pack Quantity: 3000; Length: 2.85mm; RoHS: True; Manufacturer: DiodesIncorporated; Mounting Style: SMD/SMT; Package / Case: SOD-123
Q5 Q6 = PSMN4R8-100BSEJ: N-Channel MOSFET; Published: 8-Jun-2000; LatestRevisionDate: 17-Jul-2002; LatestRevisionNote: Re-released for DXP Platform.; PackageVersion: 1995/1996; PackageReference: E3; Publisher: Altium Limited; PackageDescription: TO, Flat Index; 3 In-Line, Axial Leads; Body Dia. 4.6mm; Lead Dia. 0.5 mm (max); Supplier 1: Digi-Key; Supplier Part Number 1: 1727-1103-1-ND
Q7 = CMP-1048-00557-1: as Q4 on sheet 37V_efuse; Packing: Tape and Reel; PackageDescription: 3-Pin Small Outline Transistor, Body 2.92 x 1.3 mm, Pitch 0.95 mm; PartNumber: MMBT5401LT1G; DatasheetVersion: Rev. 11; PackageReference: SOT-23-3-318-08; Polarity: PNP; ComponentLink1URL: http://www.onsemi.com/; ComponentLink3URL: http://www.onsemi.cn/pub_link/Collateral/318-08.PDF; ComponentLink3Description: Package Specification; ComponentLink1Description: Manufacturer URL; Mounting Technology: Surface Mount; ComponentLink2URL: http://www.onsemi.cn/pub_link/Collateral/MMBT5401LT1-D.PDF; RoHS: TRUE; ComponentLink2Description: Datasheet; PackageVersion: Rev. AP, 11/2009
R47-R56 = Res1: Resistor; Published: 8-Jun-2000; LatestRevisionDate: 17-Jul-2002; LatestRevisionNote: Re-released for DXP Platform.; PackageReference: AXIAL-0.3; Publisher: Altium Limited; PackageDescription: Axial Device, Thru-Hole; 2 Leads; 0.3 in Pin Spacing
U14 = LM5069MM-2/NOPB: as U13 on sheet 37V_efuse; Supplier 1: Digi-Key; Manufacturer Part Number 1: LM5069MM-2/NOPB; Stock 1: 115715; Pricing 1: 1=3.00000, 10=2.69700, 25=2.54920, 100=2.09610, 250=1.88080, 500=1.81280 (USD); RoHS: Yes; Mount: Surface Mount; Case/Package: MSOP; Number of Pins: 10; Min Operating Temperature: -40°C; Max Operating Temperature: 125°C; Packaging: Tape and Reel; Package Quantity: 1000; Max Supply Voltage: 80V; Number of Outputs: 1; Length: 3mm; Height: 0.86mm; Depth: 3.1mm; Width: 3mm; Radiation Hardening: No; Lead Free: Lead Free; REACH SVHC: No SVHC; ComponentLink1URL: https://datasheet.ciiva.com/15099/getdatasheetpartid-628880-15099677.pdf?src-supplier=Verical; ComponentLink1Description: https://datasheet.ciiva.com/15099/getdatasheetpartid-628880-15099677.pdf?src-supplier=Verical; ComponentLink2URL: https://datasheet.ciiva.com/3222/lm5069-3222438.pdf?src-supplier=Avnet; ComponentLink2Description: https://datasheet.ciiva.com/3222/lm5069-3222438.pdf?src-supplier=Avnet; ComponentLink3URL: https://datasheet.ciiva.com/3222/lm5069-3222470.pdf?src-supplier=Avnet; ComponentLink3Description: https://datasheet.ciiva.com/3222/lm5069-3222470.pdf?src-supplier=Avnet; ComponentLink4URL: https://datasheet.ciiva.com/6609/lm5069-6609670.pdf?src-supplier=Digi-Key; ComponentLink4Description: https://datasheet.ciiva.com/6609/lm5069-6609670.pdf?src-supplier=Digi-Key; ComponentLink5URL: https://datasheet.ciiva.com/1511/1642228-1511437.pdf?src-supplier=Element14; ComponentLink5Description: https://datasheet.ciiva.com/1511/1642228-1511437.pdf?src-supplier=Element14; Supplier Part Number 1: LM5069MM-2/NOPBCT-ND

## Sheet Mounting_Holes.SchDoc
size A4; SheetNumber: 1; SheetTotal: 1
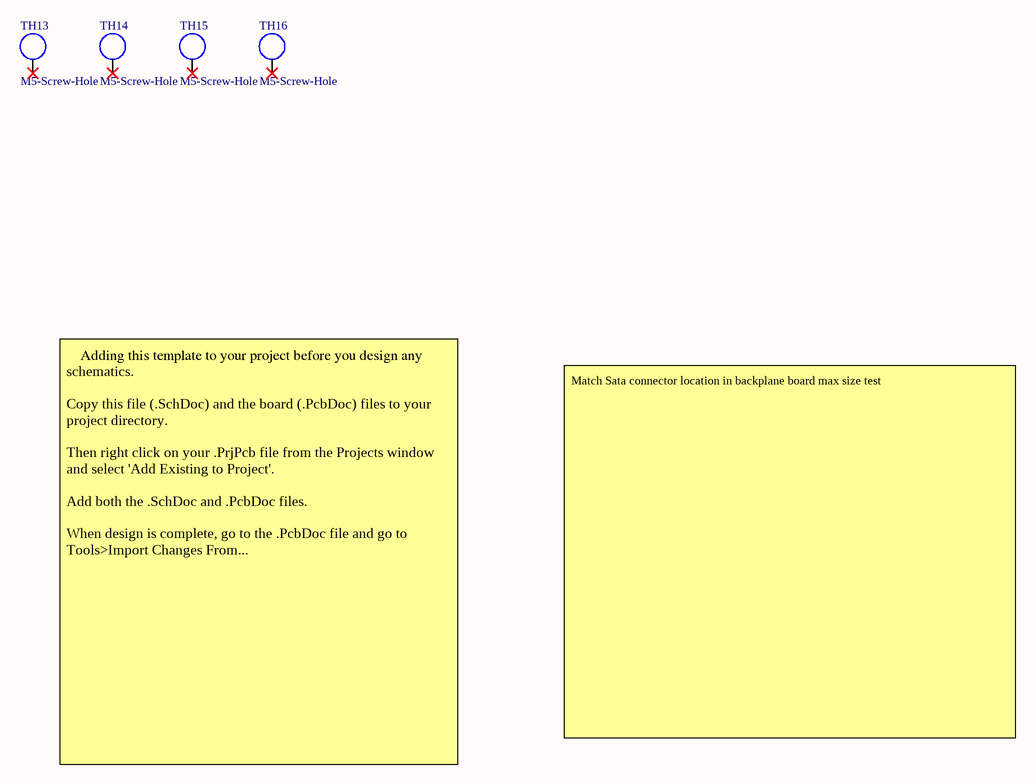
[diagram p17: Mounting_Holes.SchDoc]

### Parts
TH13  M5-Screw-Hole  [M5_Screw_Hole]
TH14  M5-Screw-Hole  [M5_Screw_Hole]
TH15  M5-Screw-Hole  [M5_Screw_Hole]
TH16  M5-Screw-Hole  [M5_Screw_Hole]

### Nets

Not connected (* = marked no-connect by the designer): TH13 1*; TH14 1*; TH15 1*; TH16 1*

### Notes on the sheet
- Match Sata connector location in backplane board max size test
- Adding this template to your project before you design any schematics.
  Copy this file (.SchDoc) and the board (.PcbDoc) files to your project directory.
  Then right click on your .PrjPcb file from the Projects window and select 'Add Existing to Project'.
  Add both the .SchDoc and .PcbDoc files.
  When design is complete, go to the .PcbDoc file and go to Tools>Import Changes From...

## Nets that join several sheets
5V: SCH-2-Main Controls (ARD1.59 R1.2 R2.2), SCH-3-ESC1 (5 pins), SCH-4-ESC2 (5 pins), SCH-5-ESC3 (5 pins), SCH-6-ESC4 (5 pins), SCH-7-ESC5 (5 pins), SCH-8-ESC6 (5 pins), SCH-11-Out Going Connectors (8 pins), 5V_board (5 pins)
12V: SCH-11-Out Going Connectors (9 pins), 12V_board (C70.1 D13.1 U11.7 U11.8)
12V_RELAY: SCH-1-Relay_circuit (5 pins), 37V_efuse (R43.1), 18V5_efuse (R53.1)
18.5VP: SCH-9-Battery Voltage Indicators (27 pins), SCH-11-Out Going Connectors (P13.1 P13.2), 3V3_board (6 pins), 5V_board (6 pins), 18V5_efuse (5 pins)
18.5VP_RAW: SCH-1-Relay_circuit (K3.87a), SCH-11-Out Going Connectors (P15.1 P15.2 P15.3 P15.4), 18V5_efuse (6 pins)
18.5VP_XTRA_RAW: SCH-1-Relay_circuit (D9.1 K4.87a), SCH-10-Power Connectors (TH5.1 TH6.1)
24V: SCH-11-Out Going Connectors (P14.1 P14.2), 24V_board (C71.1 U12.7 U12.8)
37VP: SCH-3-ESC1 (F1.1), SCH-4-ESC2 (F2.1), SCH-5-ESC3 (F3.1), SCH-6-ESC4 (F4.1), SCH-7-ESC5 (F5.1), SCH-8-ESC6 (F6.1), SCH-9-Battery Voltage Indicators (R27.2), 12V_board (C69.1 U11.1), 24V_board (U12.1)
37VP_RAW: SCH-1-Relay_circuit (K1.87a), 37V_efuse (6 pins)
37VP_XTRA_RAW: SCH-1-Relay_circuit (D8.1 K2.30), SCH-10-Power Connectors (TH1.1 TH2.1)
GND: SCH-1-Relay_circuit (11 pins), SCH-2-Main Controls (5 pins), SCH-3-ESC1 (17 pins), SCH-4-ESC2 (17 pins), SCH-5-ESC3 (17 pins), SCH-6-ESC4 (17 pins), SCH-7-ESC5 (17 pins), SCH-8-ESC6 (17 pins), SCH-9-Battery Voltage Indicators (12 pins), SCH-10-Power Connectors (TH7.1 TH8.1 TH11.1 TH12.1), SCH-11-Out Going Connectors (20 pins), 3V3_board (14 pins), 5V_board (12 pins), 12V_board (5 pins), 24V_board (C71.2 U12.3 U12.4), 37V_efuse (10 pins), 18V5_efuse (10 pins)
NetARD1_0: SCH-2-Main Controls (ARD1.0), SCH-4-ESC2 (ESC2.27 TP9.1)
NetARD1_1: SCH-2-Main Controls (ARD1.1), SCH-3-ESC1 (ESC1.27 TP4.1)
NetARD1_2: SCH-2-Main Controls (ARD1.2), SCH-8-ESC6 (U6.2)
NetARD1_3: SCH-2-Main Controls (ARD1.3), SCH-8-ESC6 (U6.1)
NetARD1_4: SCH-2-Main Controls (ARD1.4), SCH-7-ESC5 (U5.2)
NetARD1_5: SCH-2-Main Controls (ARD1.5), SCH-7-ESC5 (U5.1)
NetARD1_6: SCH-2-Main Controls (ARD1.6), SCH-6-ESC4 (U4.2)
NetARD1_7: SCH-2-Main Controls (ARD1.7), SCH-6-ESC4 (U4.1)
NetARD1_8: SCH-2-Main Controls (ARD1.8), SCH-5-ESC3 (U3.2)
NetARD1_9: SCH-2-Main Controls (ARD1.9), SCH-5-ESC3 (U3.1)
NetARD1_10: SCH-2-Main Controls (ARD1.10), SCH-4-ESC2 (U2.2)
NetARD1_11: SCH-2-Main Controls (ARD1.11), SCH-4-ESC2 (U2.1)
NetARD1_12: SCH-2-Main Controls (ARD1.12), SCH-3-ESC1 (U1.2)
NetARD1_13: SCH-2-Main Controls (ARD1.13), SCH-3-ESC1 (U1.1)
NetARD1_14: SCH-2-Main Controls (ARD1.14), SCH-5-ESC3 (ESC3.27 TP14.1)
NetARD1_15: SCH-2-Main Controls (ARD1.15), SCH-6-ESC4 (ESC4.27 TP19.1)
NetARD1_16: SCH-2-Main Controls (ARD1.16), SCH-7-ESC5 (ESC5.27 TP24.1)
NetARD1_17: SCH-2-Main Controls (ARD1.17), SCH-8-ESC6 (ESC6.27 TP29.1)
NetARD1_18: SCH-2-Main Controls (ARD1.18), SCH-11-Out Going Connectors (J1.17)
NetARD1_19: SCH-2-Main Controls (ARD1.19), SCH-11-Out Going Connectors (J1.18)
NetARD1_20: SCH-2-Main Controls (ARD1.20 ARD1.21 R1.1 R2.1), SCH-3-ESC1 (U1.3 U1.4), SCH-4-ESC2 (U2.3 U2.4), SCH-5-ESC3 (U3.3 U3.4), SCH-6-ESC4 (U4.3 U4.4), SCH-7-ESC5 (U5.3 U5.4), SCH-8-ESC6 (U6.3 U6.4), SCH-11-Out Going Connectors (J2.16 J2.17)
NetARD1_22: SCH-2-Main Controls (ARD1.22), SCH-3-ESC1 (ESC1.20)
NetARD1_23: SCH-2-Main Controls (ARD1.23), SCH-3-ESC1 (ESC1.19 R3.1)
NetARD1_24: SCH-2-Main Controls (ARD1.24), SCH-3-ESC1 (ESC1.22)
NetARD1_25: SCH-2-Main Controls (ARD1.25), SCH-3-ESC1 (ESC1.21)
NetARD1_26: SCH-2-Main Controls (ARD1.26), SCH-4-ESC2 (ESC2.22)
NetARD1_27: SCH-2-Main Controls (ARD1.27), SCH-4-ESC2 (ESC2.21)
NetARD1_28: SCH-2-Main Controls (ARD1.28), SCH-4-ESC2 (ESC2.20)
NetARD1_29: SCH-2-Main Controls (ARD1.29), SCH-4-ESC2 (ESC2.19 R7.1)
NetARD1_30: SCH-2-Main Controls (ARD1.30), SCH-5-ESC3 (ESC3.19 R11.1)
NetARD1_31: SCH-2-Main Controls (ARD1.31), SCH-5-ESC3 (ESC3.20)
NetARD1_32: SCH-2-Main Controls (ARD1.32), SCH-5-ESC3 (ESC3.21)
NetARD1_33: SCH-2-Main Controls (ARD1.33), SCH-5-ESC3 (ESC3.22)
NetARD1_34: SCH-2-Main Controls (ARD1.34), SCH-6-ESC4 (ESC4.21)
NetARD1_35: SCH-2-Main Controls (ARD1.35), SCH-6-ESC4 (ESC4.22)
NetARD1_36: SCH-2-Main Controls (ARD1.36), SCH-6-ESC4 (ESC4.19 R15.1)
NetARD1_37: SCH-2-Main Controls (ARD1.37), SCH-6-ESC4 (ESC4.20)
NetARD1_38: SCH-2-Main Controls (ARD1.38), SCH-7-ESC5 (ESC5.21)
NetARD1_39: SCH-2-Main Controls (ARD1.39), SCH-7-ESC5 (ESC5.22)
NetARD1_40: SCH-2-Main Controls (ARD1.40), SCH-7-ESC5 (ESC5.19 R19.1)
NetARD1_41: SCH-2-Main Controls (ARD1.41), SCH-7-ESC5 (ESC5.20)
NetARD1_42: SCH-2-Main Controls (ARD1.42), SCH-8-ESC6 (ESC6.19 R23.1)
NetARD1_43: SCH-2-Main Controls (ARD1.43), SCH-8-ESC6 (ESC6.20)
NetARD1_44: SCH-2-Main Controls (ARD1.44), SCH-8-ESC6 (ESC6.21)
NetARD1_45: SCH-2-Main Controls (ARD1.45), SCH-8-ESC6 (ESC6.22)
NetARD1_60: SCH-2-Main Controls (ARD1.60), SCH-8-ESC6 (ESC6.24)
NetARD1_61: SCH-2-Main Controls (ARD1.61), SCH-8-ESC6 (ESC6.25)
NetARD1_62: SCH-2-Main Controls (ARD1.62), SCH-7-ESC5 (ESC5.24)
NetARD1_63: SCH-2-Main Controls (ARD1.63), SCH-7-ESC5 (ESC5.25)
NetARD1_64: SCH-2-Main Controls (ARD1.64), SCH-6-ESC4 (ESC4.24)
NetARD1_65: SCH-2-Main Controls (ARD1.65), SCH-6-ESC4 (ESC4.25)
NetARD1_66: SCH-2-Main Controls (ARD1.66), SCH-3-ESC1 (ESC1.25)
NetARD1_67: SCH-2-Main Controls (ARD1.67), SCH-3-ESC1 (ESC1.24)
NetARD1_68: SCH-2-Main Controls (ARD1.68), SCH-4-ESC2 (ESC2.25)
NetARD1_69: SCH-2-Main Controls (ARD1.69), SCH-4-ESC2 (ESC2.24)
NetARD1_70: SCH-2-Main Controls (ARD1.70), SCH-5-ESC3 (ESC3.25)
NetARD1_71: SCH-2-Main Controls (ARD1.71), SCH-5-ESC3 (ESC3.24)
NetPS1_1: 3V3_board (PS2.1), 5V_board (PS1.1), 18V5_efuse (R53.2 TP37.1 U14.8)
NetR43_2: 12V_board (U11.2), 24V_board (U12.2), 37V_efuse (R43.2 TP36.1 U13.8)